# Altium project limsw-26.PrjPcb
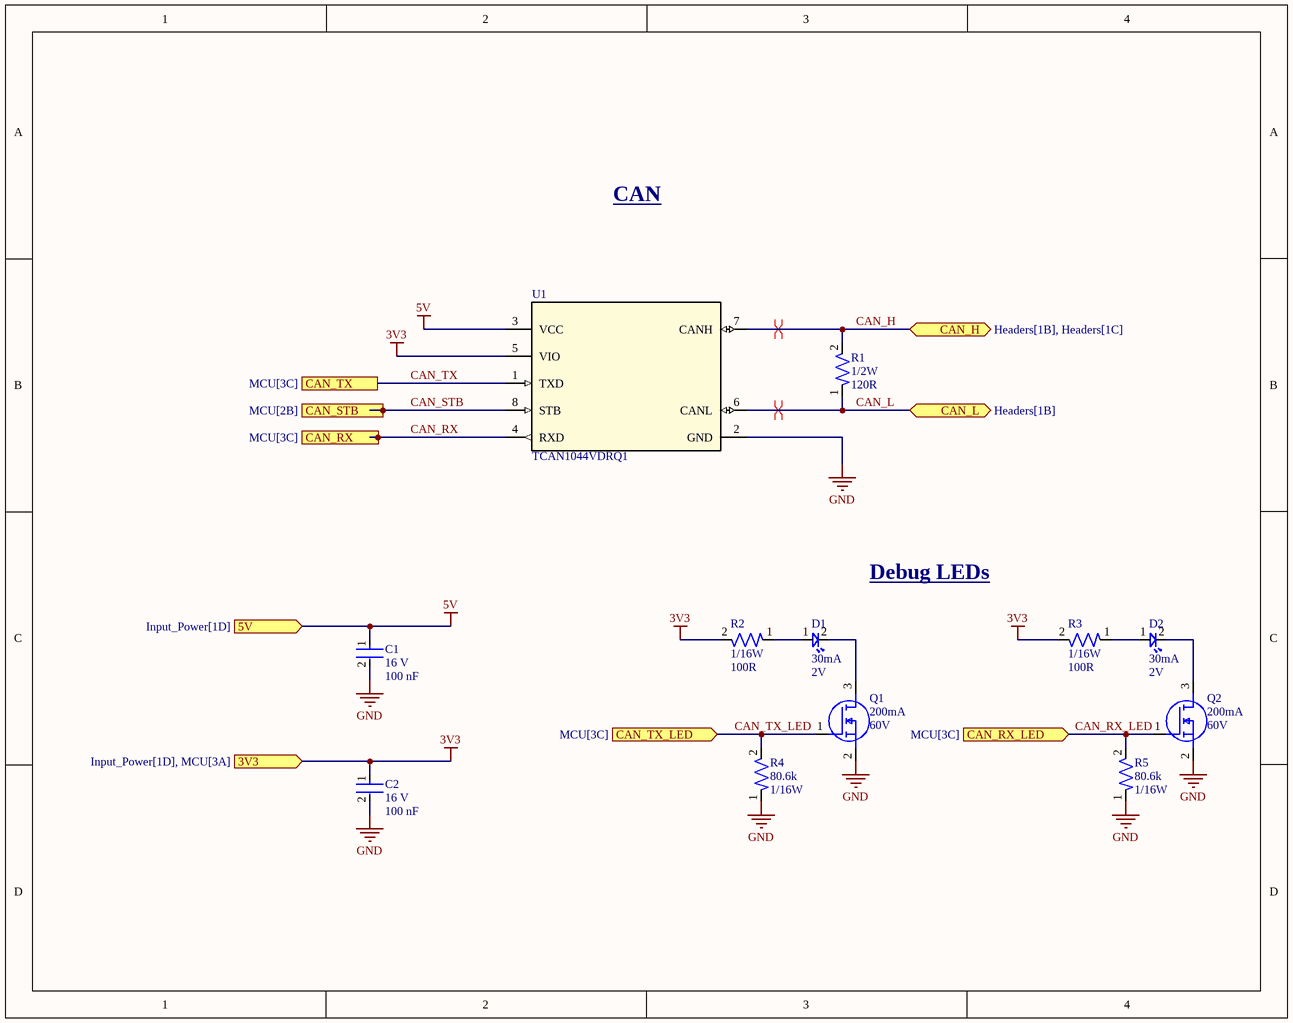
[diagram p0: CAN.SchDoc]
4 sheets, 51 parts. Net scope: flat (ports and power ports of the same name join across sheets).
Board file: PCB1.PcbDoc
Sheets:
  CAN.SchDoc
  MCU.SchDoc
  Input_Power.SchDoc
  Headers.SchDoc

## Sheet CAN.SchDoc
size A; SheetNumber: 1; SheetTotal: 4

### Parts
C1  Voltage Rating: 16 V  Capacitance: 100 nF  [CAP-0402]  (hidden comment: CC0402KRX7R7BB104)
C2  Voltage Rating: 16 V  Capacitance: 100 nF  [CAP-0402]  (hidden comment: CC0402KRX7R7BB104)
D1  Forward Current: 30mA  Forward Voltage: 2V  [LED-0603]  (hidden comment: BL-HKC36G-AV-TRB)
D2  Forward Current: 30mA  Forward Voltage: 2V  [LED-0603]  (hidden comment: BL-HKC36G-AV-TRB)
Q1  Continuous Current: 200mA  Voltage: 60V  [IC-SOT23-3]  (hidden comment: T2N7002AK,LM)
Q2  Continuous Current: 200mA  Voltage: 60V  [IC-SOT23-3]  (hidden comment: T2N7002AK,LM)
R1  Power: 1/2W  Resistance: 120R  [RES-1210]  (hidden comment: RC1210FR-07120RL)
R2  Power: 1/16W  Resistance: 100R  [RES-0402]  (hidden comment: RC0402FR-07100RL)
R3  Power: 1/16W  Resistance: 100R  [RES-0402]  (hidden comment: RC0402FR-07100RL)
R4  Resistance: 80.6k  Power: 1/16W  [RES-0402]  (hidden comment: RC0402FR-0780K6L)
R5  Resistance: 80.6k  Power: 1/16W  [RES-0402]  (hidden comment: RC0402FR-0780K6L)
U1  TCAN1044VDRQ1  [IC-8SOIC]

### Ports
3V3 (in, see Input_Power[1D], MCU[3A]), 5V (in, see Input_Power[1D]), CAN_H (bidir, see Headers[1B], Headers[1C]), CAN_L (bidir, see Headers[1B]), CAN_RX (see MCU[3C]), CAN_RX_LED (in, see MCU[3C]), CAN_STB (see MCU[2B]), CAN_TX (see MCU[3C]), CAN_TX_LED (in, see MCU[3C])

### Nets
3V3: C2.1 R2.2 R3.2 U1.5(VIO) ; port 3V3  [project net VBAT]
5V: C1.1 U1.3(VCC) ; port 5V
GND: C1.2 C2.2 Q1.2(S) Q2.2(S) R4.1 R5.1 U1.2(GND)
CAN_H: R1.2 U1.7(CANH) ; port CAN_H
CAN_L: R1.1 U1.6(CANL) ; port CAN_L
CAN_RX: U1.4(RXD) ; port CAN_RX
CAN_RX_LED: Q2.1(G) R5.2 ; port CAN_RX_LED
CAN_STB: U1.8(STB) ; port CAN_STB
CAN_TX: U1.1(TXD) ; port CAN_TX
CAN_TX_LED: Q1.1(G) R4.2 ; port CAN_TX_LED
NetD1_1: D1.1 R2.1
NetD1_2: D1.2 Q1.3(D)
NetD2_1: D2.1 R3.1
NetD2_2: D2.2 Q2.3(D)

### Layout directives
differential pair: CAN_H, CAN_L

### Notes on the sheet
- CAN
- Debug LEDs

### Library data of the parts
C1 C2 = CAP-0.1U-0001: CAP CER 0.1UF 16V X7R 0402; ComponentLink2Description: Datasheet; ComponentLink2URL: https://www.yageo.com/upload/media/product/productsearch/datasheet/mlcc/UPY-GPHC_X7R_6.3V-to-250V_24.pdf; Device Class: Ceramic; Size: 0402
D1 D2 = LED-0001: LED YELLOW CLEAR 0603 SMD; ComponentLink1Description: Datasheet; ComponentLink1URL: https://www.americanbrightled.com/pdffiles/led-components/smt/BL-HKC36G-AV-TRB.pdf
Q1 Q2 = NMOS-200MA-0001: MOSFET N-CH 60V 200MA SOT23; ComponentLink1Description: Datasheet; ComponentLink1URL: https://toshiba.semicon-storage.com/info/T2N7002AK_datasheet_en_20150401.pdf?did=29712&prodName=T2N7002AK
R1 = RES-120-0001: RES 120 OHM 1% 1/2W 1210; Tolerance: 1%; Size: 1210; ComponentLink1Description: Datasheet; ComponentLink1URL: https://www.yageo.com/upload/media/product/products/datasheet/rchip/PYu-RC_Group_51_RoHS_L_12.pdf
R2 R3 = RES-100-0001: RES 100 OHM 1% 1/16W 0402; Tolerance: 1%; Size: 0402; ComponentLink1Description: Datasheet; ComponentLink1URL: https://www.yageo.com/upload/media/product/products/datasheet/rchip/PYu-RC_Group_51_RoHS_L_12.pdf
R4 R5 = RES-80.6k-0001: 80.6 kOhms ±1% 0.063W, 1/16W Chip Resistor 0402 (1005 Metric) Moisture Resistant Thick Film; Tolerance: 1%; Size: 0402; ComponentLink1Description: Datasheet; ComponentLink1URL: https://www.yageo.com/upload/media/product/products/datasheet/rchip/PYu-RC_Group_51_RoHS_L_12.pdf
U1 = IC-CAN-0001: IC TRANSCEIVER 1/1 8SOIC; ComponentLink1Description: Datasheet; ComponentLink1URL: https://www.ti.com/lit/ds/symlink/tcan1044-q1.pdf?HQS=dis-dk-null-digikeymode-dsf-pf-null-wwe&ts=1728758303289&ref_url=https%253A%252F%252Fwww.ti.com%252Fgeneral%252Fdocs%252Fsuppproductinfo.tsp%253FdistId%253D10%2526gotoUrl%253Dhttps%253A%252F%252Fwww.ti.com%252Flit%252Fgpn%252Ftcan1044-q1

## Sheet MCU.SchDoc
size A; SheetNumber: 2; SheetTotal: 4
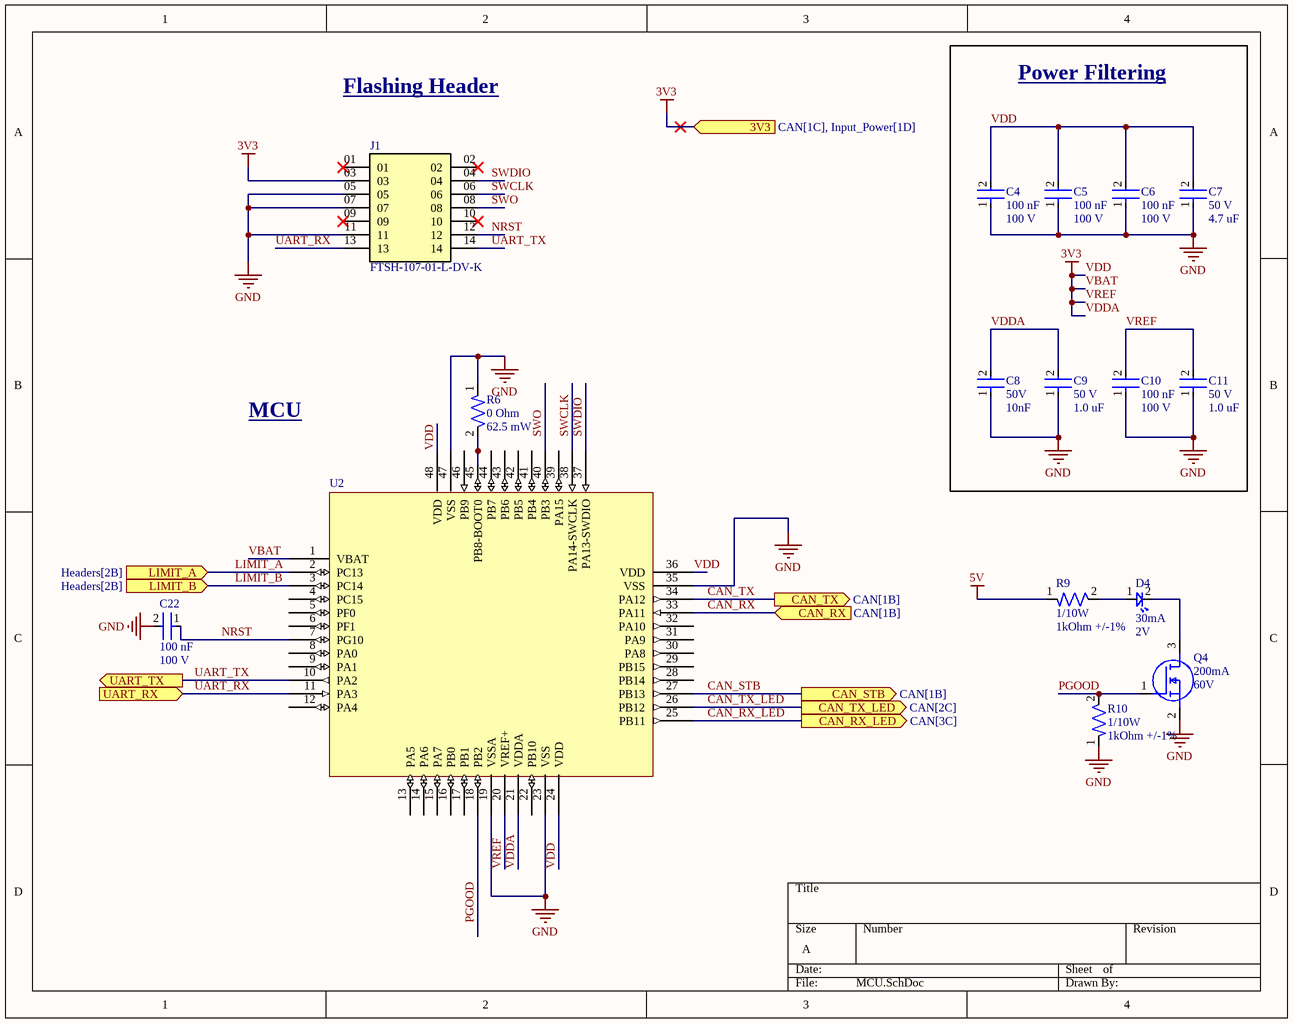
[diagram p1: MCU.SchDoc]

### Parts
C4  Capacitance: 100 nF  Voltage: 100 V  [CAP-0603]  (hidden comment: CC0603KRX7R0BB104)
C5  Capacitance: 100 nF  Voltage: 100 V  [CAP-0603]  (hidden comment: CC0603KRX7R0BB104)
C6  Capacitance: 100 nF  Voltage: 100 V  [CAP-0603]  (hidden comment: CC0603KRX7R0BB104)
C7  Voltage: 50 V  Capacitance: 4.7 uF  [CAP-0805]  (hidden comment: CC0805KKX5R9BB475)
C8  Voltage: 50V  Capacitance: 10nF  [CAP-0805]  (hidden comment: GRM2195C1H103JA01D)
C9  Voltage: 50 V  Capacitance: 1.0 uF  [CAP-0805]  (hidden comment: CC0805KKX7R9BB105)
C10  Capacitance: 100 nF  Voltage: 100 V  [CAP-0603]  (hidden comment: CC0603KRX7R0BB104)
C11  Voltage: 50 V  Capacitance: 1.0 uF  [CAP-0805]  (hidden comment: CC0805KKX7R9BB105)
C22  Capacitance: 100 nF  Voltage: 100 V  [CAP-0603]  (hidden comment: CC0603KRX7R0BB104)
D4  Forward Current: 30mA  Forward Voltage: 2V  [LED-0603]  (hidden comment: BL-HKC36G-AV-TRB)
J1  FTSH-107-01-L-DV-K  [SAMTEC_FTSH-107-01-L-DV-K]
Q4  Continuous Current: 200mA  Voltage: 60V  [IC-SOT23-3]  (hidden comment: T2N7002AK,LM)
R6  Resistance: 0 Ohm  Power: 62.5 mW  [RES-0402]  (hidden comment: RC0402FR-070RL)
R9  Power Rating: 1/10W  Resistance: 1kOhm +/-1%  [RES-0603]  (hidden comment: RT0603FRE131KL)
R10  Power Rating: 1/10W  Resistance: 1kOhm +/-1%  [RES-0603]  (hidden comment: RT0603FRE131KL)
U2  STM32G431CBT6  [IC-LQFP48]  (value not drawn)

### Blocks framed on the sheet
Power Filtering: C4-C11

### Ports
3V3 (in, see CAN[1C], Input_Power[1D]), CAN_RX (in, see CAN[1B]), CAN_RX_LED (out, see CAN[3C]), CAN_STB (out, see CAN[1B]), CAN_TX (out, see CAN[1B]), CAN_TX_LED (out, see CAN[2C]), LIMIT_A (in, see Headers[2B]), LIMIT_B (in, see Headers[2B]), UART_RX (in), UART_TX (out)

### Nets
5V: R9.1
GND: C4.1 C5.1 C6.1 C7.1 C8.1 C9.1 C10.1 C11.1 C22.2 J1.05 J1.07 J1.11 Q4.2(S) R6.1 R10.1 U2.19(VSSA) U2.23(VSS) U2.35(VSS) U2.47(VSS)
VBAT: C4.2 C5.2 C6.2 C7.2 C8.2 C9.2 C10.2 C11.2 J1.03 U2.1(VBAT) U2.20(VREF+) U2.21(VDDA) U2.24(VDD) U2.36(VDD) U2.48(VDD) ; port 3V3  [also labelled 3V3, VDD, VDDA, VREF]
CAN_RX: U2.33(PA11) ; port CAN_RX
CAN_RX_LED: U2.25(PB11) ; port CAN_RX_LED
CAN_STB: U2.27(PB13) ; port CAN_STB
CAN_TX: U2.34(PA12) ; port CAN_TX
CAN_TX_LED: U2.26(PB12) ; port CAN_TX_LED
LIMIT_A: U2.2(PC13) ; port LIMIT_A
LIMIT_B: U2.3(PC14) ; port LIMIT_B
NRST: C22.1 J1.12 U2.7(PG10)
PGOOD: Q4.1(G) R10.2 U2.18(PB2)
SWCLK: J1.06 U2.38(PA14-SWCLK)
SWDIO: J1.04 U2.37(PA13-SWDIO)
SWO: J1.08 U2.40(PB3)
UART_RX: J1.13 U2.11(PA3) ; port UART_RX
UART_TX: J1.14 U2.10(PA2) ; port UART_TX
NetD4_1: D4.1 R9.2
NetD4_2: D4.2 Q4.3(D)
NetR6_2: R6.2 U2.45(PB8-BOOT0)

Not connected (* = marked no-connect by the designer): J1 01* 02* 09* 10*; U2 4(PC15) 5(PF0) 6(PF1) 8(PA0) 9(PA1) 12(PA4) 13(PA5) 14(PA6) 15(PA7) 16(PB0) 17(PB1) 22(PB10) 28(PB14) 29(PB15) 30(PA8) 31(PA9) 32(PA10) 39(PA15) 41(PB4) 42(PB5) 43(PB6) 44(PB7) 46(PB9)

### Notes on the sheet
- Flashing Header
- MCU

### Library data of the parts
C4-C6 C10 C22 = CAP-100N-0001: CAP CER 0.1UF 100V X7R 0603; Device Class: Ceramic; Size: 0603; ComponentLink1Description: Datasheet; ComponentLink1URL: https://www.yageo.com/upload/media/product/app/datasheet/mlcc/upy-np0x7r_mv_100-to-630v.pdf
C7 = CAP-4.7U-0002: CAP CER 4.7UF 50V X5R 0805; ComponentLink2Description: Datasheet; ComponentLink2URL: http://www.yageo.com/documents/recent/UPY-GPHC_Y5V_6.3V-to-50V_8.pdf; Device Class: Ceramic; Size: 0805
C8 = CAP-10N-0001: CAP CER 10000PF 50V C0G/NP0 0805; Device Class: Ceramic; Size: 0805; ComponentLink1Description: Datasheet; ComponentLink1URL: https://search.murata.co.jp/Ceramy/image/img/A01X/G101/ENG/GRM2195C1H103JA01-01.pdf
C9 C11 = CAP-1U-0001: CAP CER 1UF 50V X7R 0805; ComponentLink2URL: https://www.yageo.com/upload/media/product/productsearch/datasheet/mlcc/UPY-GPHC_X7R_6.3V-to-250V_24.pdf; ComponentLink2Description: Datasheet; Device Class: Ceramic; Size: 0805
D4 = LED-0001: LED YELLOW CLEAR 0603 SMD; ComponentLink1Description: Datasheet; ComponentLink1URL: https://www.americanbrightled.com/pdffiles/led-components/smt/BL-HKC36G-AV-TRB.pdf
J1 = CONN_Flashing-0001: Connector Header Surface Mount 14 position 0.050" (1.27mm); MF: Samtec; Value: *; Price: None; Package: None; Availability: Unavailable; MP: FTSH-107-01-L-DV-K; ComponentLink1Description: Datasheet; ComponentLink1URL: https://mm.digikey.com/Volume0/opasdata/d220001/medias/docus/6209/ftsh-1xx-xx-xxx-dv-xxx-xxx-x-xx-mkt.pdf
Q4 = NMOS-200MA-0001: MOSFET N-CH 60V 200MA SOT23; ComponentLink1Description: Datasheet; ComponentLink1URL: https://toshiba.semicon-storage.com/info/T2N7002AK_datasheet_en_20150401.pdf?did=29712&prodName=T2N7002AK
R6 = RES-0-0002-JLC: 62.5mW Thick Film Resistors 50V -55℃~+155℃ 0Ω 0402 Chip Resistor - Surface Mount ROHS; assembled?: yes; JLC part number: C106231
R9 R10 = RES-1K-0002: 1 kOhms ±1% 0.1W, 1/10W Chip Resistor 0603 (1608 Metric) Thin Film; Manufacturer: YAGEO; Assembled?: no; Manufacturer Part Number: RT0603FRE131KL; Package Size: 0603
U2 = IC-STM32G431CBT6: IC MCU 32BIT 128KB FLASH 48LQFP; Package: 48LQFP; ComponentLink1Description: Datasheet; ComponentLink1URL: https://www.st.com/resource/en/datasheet/stm32g431cb.pdf

## Sheet Input_Power.SchDoc
size A; SheetNumber: 4; SheetTotal: 5
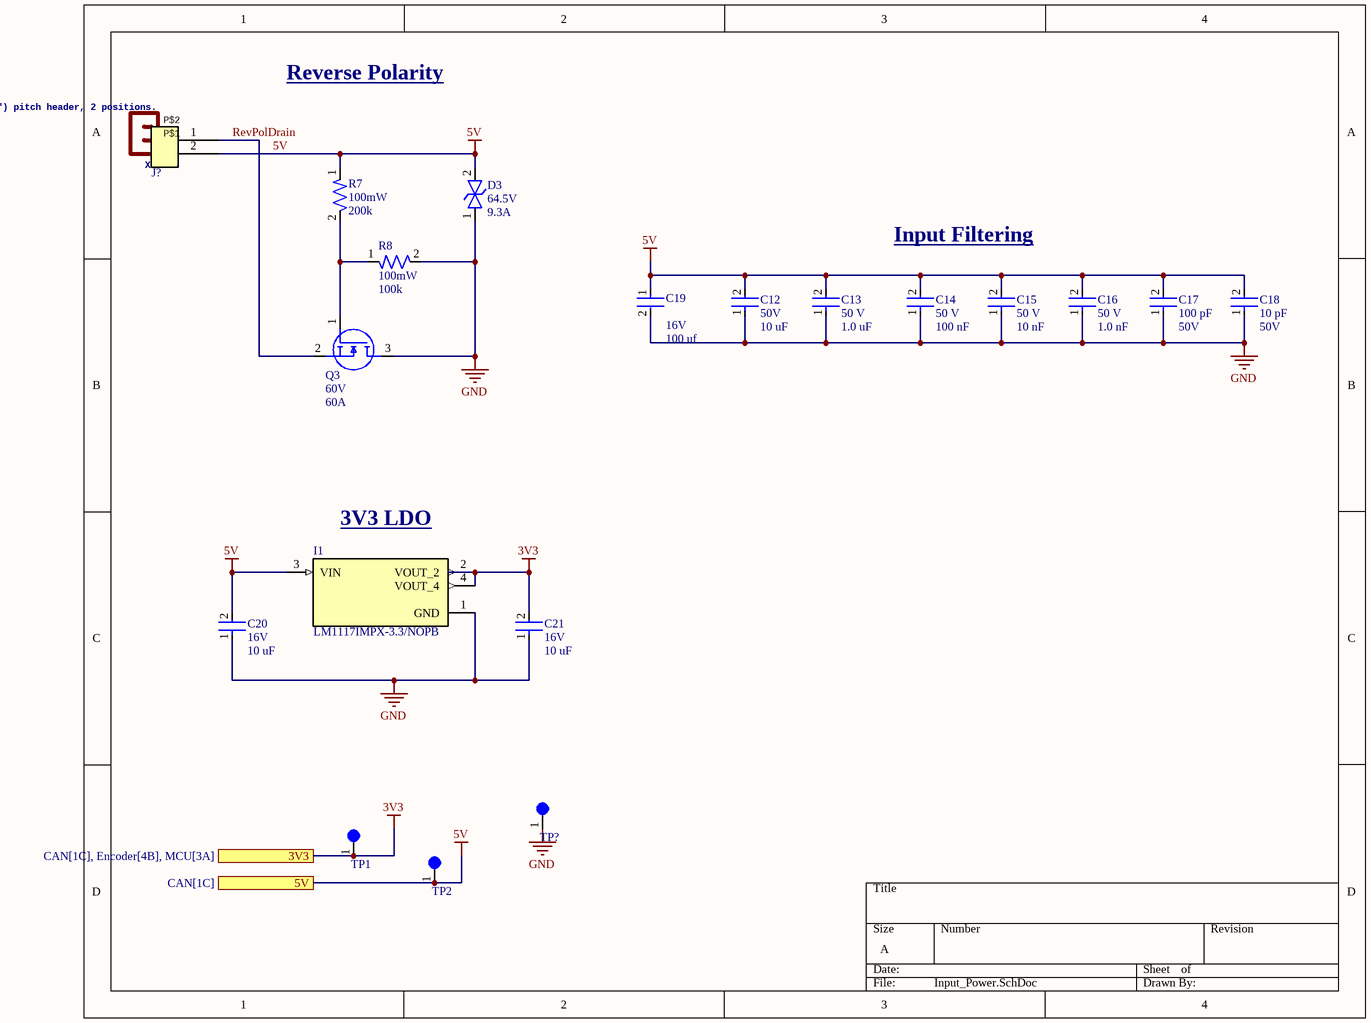
[diagram p2: Input_Power.SchDoc]

### Parts
C12  Voltage: 50V  Capacitance: 10 uF  [CAP-1210]  (hidden comment: CL32B106KBJNNNE)
C13  Voltage: 50 V  Capacitance: 1.0 uF  [CAP-0805]  (hidden comment: CC0805KKX7R9BB105)
C14  Voltage Rating: 50 V  Capacitance: 100 nF  [CAP-0805]  (hidden comment: CC0805KRX7R9BB104)
C15  Voltage: 50 V  Capacitance: 10 nF  [CAP-0603]  (hidden comment: CC0603KPX7R9BB103)
C16  Voltage: 50 V  Capacitance: 1.0 nF  [CAP-0402]  (hidden comment: CC0402KRX7R9BB102)
C17  Capacitance: 100 pF  Voltage: 50V  [CAP-0402]  (hidden comment: CC0402JRNPO9BN101)
C18  Capacitance: 10 pF  Voltage: 50V  [CAP-0402]  (hidden comment: CC0402JRNPO9BN100)
C19  Parameter 2: 16V  Parameter 1: 100 uf  [CAP_EMK325AB_3P2X2P5_TAY-M]  (hidden comment: EMK325ABJ107MM-T)
C20  Voltage: 16V  Capacitance: 10 uF  [CAP-1206]  (hidden comment: 293D106X9016A2TE3)
C21  Voltage: 16V  Capacitance: 10 uF  [CAP-1206]  (hidden comment: 293D106X9016A2TE3)
D3  Voltage Rating: 64.5V  Current Rating: 9.3A  [DO-214AA (SMBJ)]  (hidden comment: SMBJ6.0)
I1  LM1117IMPX-3.3/NOPB  [IC-SOT-223-4]
J?  0430450212  [CONN-2POS-0001]  (value not drawn)
Q3  Voltage: 60V  Continuous Current: 60A  [IC-8VSONCLIP]  (hidden comment: CSD18543Q3AT)
R7  Power: 100mW  Resistance: 200k  [RES-0603]  (hidden comment: RC0603FR-07200KL)
R8  Power: 100mW  Resistance: 100k  [RES-0603]  (hidden comment: RC0603FR-07100KL)
TP1  5003  [TEST-POINT-0001]  (value not drawn)
TP2  5003  [TEST-POINT-0001]  (value not drawn)
TP3  5003  [TEST-POINT-0001]  (value not drawn)
X?  Molex - Micro-Fit 3.0 Series connector,  3.00mm (0.118") pitch header, 2 positions.  [43045-0212]

### Ports
3V3 (see CAN[1C], Encoder[4B], MCU[3A]), 5V (see CAN[1C])

### Nets
3V3: C21.2 I1.2(VOUT_2) I1.4(VOUT_4) TP1.1 ; port 3V3  [project net VBAT]
5V: C12.2 C13.2 C14.2 C15.2 C16.2 C17.2 C18.2 C19.1 C20.2 D3.2 I1.3(VIN) J?.2 R7.1 TP2.1 ; port 5V
GND: C12.1 C13.1 C14.1 C15.1 C16.1 C17.1 C18.1 C19.2 C20.1 C21.1 D3.1 I1.1(GND) Q3.3(D) R8.2 TP3.1
RevPolDrain: J?.1 Q3.2(S)
NetQ3_1: Q3.1(G) R7.2 R8.1

Not connected (* = marked no-connect by the designer): X? P$1(1) P$2(2)

### Notes on the sheet
- Reverse Polarity
- Input Filtering
- (near I1) 3V3 LDO

### Library data of the parts
C12 = CAP-10U-0002: CAP CER 10UF 50V X7R 1210; Device Class: Ceramic; Size: 1210; ComponentLink1Description: Datasheet; ComponentLink1URL: https://mm.digikey.com/Volume0/opasdata/d220001/medias/docus/41/CL32B106KBJNNNE_Spec.pdf
C13 = CAP-1U-0001: CAP CER 1UF 50V X7R 0805; ComponentLink2URL: https://www.yageo.com/upload/media/product/productsearch/datasheet/mlcc/UPY-GPHC_X7R_6.3V-to-250V_24.pdf; ComponentLink2Description: Datasheet; Device Class: Ceramic; Size: 0805
C14 = CAP-0.1U-0002: CAP CER 0.1UF 50V X7R 0805; ComponentLink2Description: Datasheet; ComponentLink2URL: https://www.yageo.com/upload/media/product/productsearch/datasheet/mlcc/UPY-GPHC_X7R_6.3V-to-250V_24.pdf; Device Class: Ceramic; Size: 0805
C15 = CAP-10N-0002: CAP CER 10000PF 50V X7R 0603; ComponentLink2Description: Datasheet; ComponentLink2URL: http://www.yageo.com/documents/recent/UPY-GPHC_X7R_6.3V-to-50V_18.pdf; Device Class: Ceramic; Size: 0603
C16 = CAP-1N-0001: CAP CER 1000PF 50V X7R 0402; ComponentLink2Description: Datasheet; ComponentLink2URL: http://www.yageo.com/documents/recent/UPY-GP_NP0_16V-to-50V_16.pdf; Device Class: Ceramic; Size: 0402
C17 = CAP-100P-0001: CAP CER 100PF 50V C0G/NPO 0402; Device Class: Ceramic; Size: 0402; ComponentLink1Description: Datasheet; ComponentLink1URL: https://www.yageo.com/upload/media/product/productsearch/datasheet/mlcc/UPY-GP_NP0_16V-to-50V_18.pdf
C18 = CAP-10P-0001: CAP CER 10PF 50V C0G/NPO 0402; Device Class: Ceramic; Size: 0402; ComponentLink1Description: Datasheet; ComponentLink1URL: https://www.yageo.com/upload/media/product/productsearch/datasheet/mlcc/UPY-GP_NP0_16V-to-50V_18.pdf
C19 = CAP-100uf-16v: CAP CER 100UF 16V X5R 1210; Mfr_Name: Taiyo Yuden
C20 C21 = CAP-10U-0004: CAP TANT 10UF 10% 16V 1206; Device Class: Tantalum; Size: 1206; ComponentLink1Description: Datasheet; ComponentLink1URL: https://www.lcsc.com/datasheet/lcsc_datasheet_2304140030_Vishay-Intertech-293D106X9016A2TE3_C110038.pdf
D3 = DIO-TVS-0001: TVS DIODE 40VWM 64.5VC DO214AA; ComponentLink1Description: Datasheet; ComponentLink1URL: https://www.littelfuse.com/media?resourcetype=datasheets&itemid=09a6ae9a-73cb-4ac4-acac-e6dab92ab953&filename=littelfuse_tvs_diode_smbj_datasheet.pdf
I1 = IC_LDO_3V3_0001: IC REG LIN 3.3V 800MA SOT223-4; ComponentLink1Description: New link; ComponentLink1URL: https://www.ti.com/lit/ds/symlink/lm1117.pdf?HQS=dis-dk-null-digikeymode-dsf-pf-null-wwe&ts=1721700739746
J? = CONN-2POS-0001: CONN HEADER VERT 2POS; ComponentLink1Description: Datasheet; ComponentLink1URL: https://tools.molex.com/pdm_docs/ps/PS-43045.pdf
Q3 = NMOS-60A-0001: MOSFET N-CH 60V 12A/60A 8VSON; ComponentLink2Description: Datasheet; ComponentLink2URL: http://www.ti.com/lit/ds/symlink/csd18543q3a.pdf
R7 = RES-200k-0001: RES SMD 200K OHM 1% 1/10W 0603; Tolerance: 1%; Size: 0603; ComponentLink1Description: Datasheet; ComponentLink1URL: https://www.yageo.com/upload/media/product/products/datasheet/rchip/PYu-RC_Group_51_RoHS_L_12.pdf
R8 = RES-100k-0001: RES SMD 100K OHM 1% 1/10W 0603; Tolerance: 1%; Size: 0603; ComponentLink1Description: Datasheet; ComponentLink1URL: https://www.yageo.com/upload/media/product/products/datasheet/rchip/PYu-RC_Group_51_RoHS_L_12.pdf
TP1-TP3 = TEST-POINT-0001: Oranange PC Test Point, Miniature Phoisphor Bronze Silver Plating Through Hole Mounting Type
X? = HEADER_POS2_?43045-0212: GateName_1: G$1; SymbolName_1: HEADER_POS2; DeviceName: 43045-0212; LibraryName: con-molex-micro-fit-3_0_2; DeviceSetName: HEADER_POS2_?; Package: 43045-0212

## Sheet Headers.SchDoc
size A; SheetNumber: 4; SheetTotal: 4
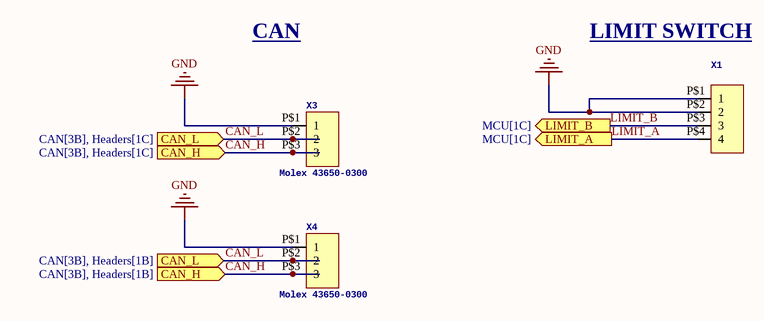
[diagram p3: Headers.SchDoc]

### Parts
X1  Molex - Micro-Fit 3.0 Series connector,  3.00mm (0.118") pitch header, 4 positions.  [43045-0400]  (value not drawn)
X3  Molex 43650-0300  [43650-0300]
X4  Molex 43650-0300  [43650-0300]

### Ports
CAN_H (in, see CAN[3B], Headers[1B]), CAN_H (in, see CAN[3B], Headers[1C]), CAN_L (in, see CAN[3B], Headers[1B]), CAN_L (in, see CAN[3B], Headers[1C]), LIMIT_A (out, see MCU[1C]), LIMIT_B (out, see MCU[1C])

### Nets
GND: X1.P$1(1) X1.P$2(2) X3.P$1(1) X4.P$1(1)
CAN_H: X3.P$3(3) X4.P$3(3) ; port CAN_H
CAN_L: X3.P$2(2) X4.P$2(2) ; port CAN_L
LIMIT_A: X1.P$4(4) ; port LIMIT_A
LIMIT_B: X1.P$3(3) ; port LIMIT_B

### Notes on the sheet
- CAN
- LIMIT SWITCH

### Library data of the parts
X1 = HEADER_POS4_?43045-0401: GateName_1: G$1; SymbolName_1: HEADER_POS4; DeviceName: 43045-0401; LibraryName: con-molex-micro-fit-3_0_2; DeviceSetName: HEADER_POS4_?; Package: 43045-0400
X3 X4 = Micro-Fit Molex 3 Pin Right Angle: GateName_1: G$1; SymbolName_1: HEADER_POS3; DeviceSetName: HEADER_POS3_?; DeviceName: 43650-0300; LibraryName: con-molex-micro-fit-3_0_2; Package: 43650-0300

## Nets that join several sheets
5V: CAN (C1.1 U1.3), MCU (R9.1), Input_Power (14 pins)
GND: CAN (7 pins), MCU (19 pins), Input_Power (15 pins), Headers (X1.P$1 X1.P$2 X3.P$1 X4.P$1)
VBAT: CAN (C2.1 R2.2 R3.2 U1.5), MCU (15 pins), Input_Power (C21.2 I1.2 I1.4 TP1.1)
CAN_H: CAN (R1.2 U1.7), Headers (X3.P$3 X4.P$3)
CAN_L: CAN (R1.1 U1.6), Headers (X3.P$2 X4.P$2)
CAN_RX: CAN (U1.4), MCU (U2.33)
CAN_RX_LED: CAN (Q2.1 R5.2), MCU (U2.25)
CAN_STB: CAN (U1.8), MCU (U2.27)
CAN_TX: CAN (U1.1), MCU (U2.34)
CAN_TX_LED: CAN (Q1.1 R4.2), MCU (U2.26)
LIMIT_A: MCU (U2.2), Headers (X1.P$4)
LIMIT_B: MCU (U2.3), Headers (X1.P$3)